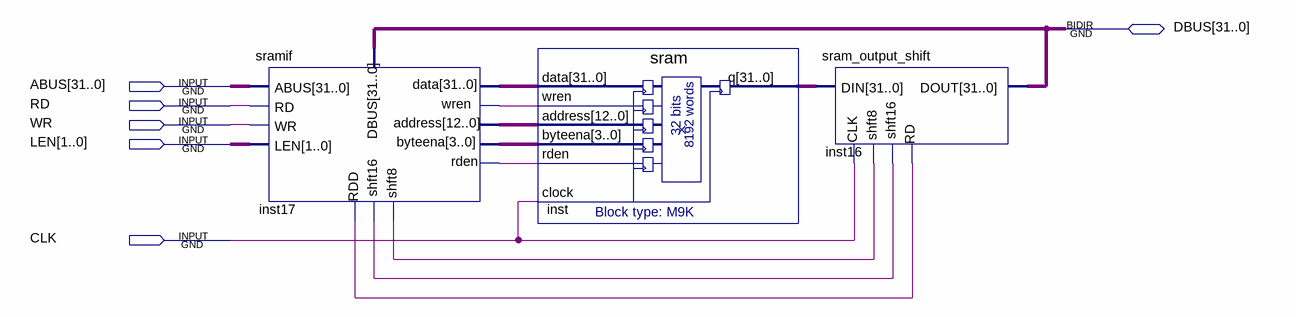
[diagram p0: schematic sheet]
// Quartus schematic sram_controller.bdf as structural Verilog: 3 symbols, 6 pins
module sram_controller (
  input  [31:0] ABUS,
  input  RD,
  input  WR,
  input  [1:0] LEN,
  input  CLK,
  inout  [31:0] DBUS
);

  wire inst17_rdd, inst17_rden, inst17_shft8, inst17_shft16, inst17_wren;
  wire [3:0] inst17_byteena;
  wire [12:0] inst17_address;
  wire [31:0] inst17_data, inst_q;

  sramif inst17 (
    .ABUS(ABUS), .RD(RD), .WR(WR), .LEN(LEN), .DBUS(DBUS), .wren(inst17_wren), .address(inst17_address),
    .byteena(inst17_byteena), .rden(inst17_rden), .shft16(inst17_shft16), .shft8(inst17_shft8),
    .data(inst17_data), .RDD(inst17_rdd));
  sram inst (
    .data(inst17_data), .wren(inst17_wren), .address(inst17_address), .byteena(inst17_byteena),
    .rden(inst17_rden), .clock(CLK), .q(inst_q));
  sram_output_shift inst16 (
    .shft16(inst17_shft16), .DIN(inst_q), .shft8(inst17_shft8), .RD(inst17_rdd), .CLK(CLK), .DOUT(DBUS));
endmodule
